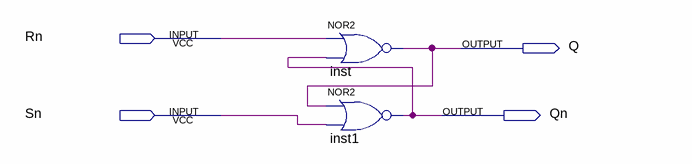
[diagram p0: schematic sheet]
// Quartus schematic SRlatch.bdf as structural Verilog: 2 symbols, 4 pins
module SRlatch (
  input  Rn,
  input  Sn,
  output Q,
  output Qn
);

  nor inst (Q, Rn, Qn);
  nor inst1 (Qn, Q, Sn);
endmodule
